# EAGLE design Compressions_TOF_VLX6180_v1.3.1_mar2022 (EAGLE 9.6.2)
COMPANY: Adafruit Industries; DRAWN: KTOWN; REV: A
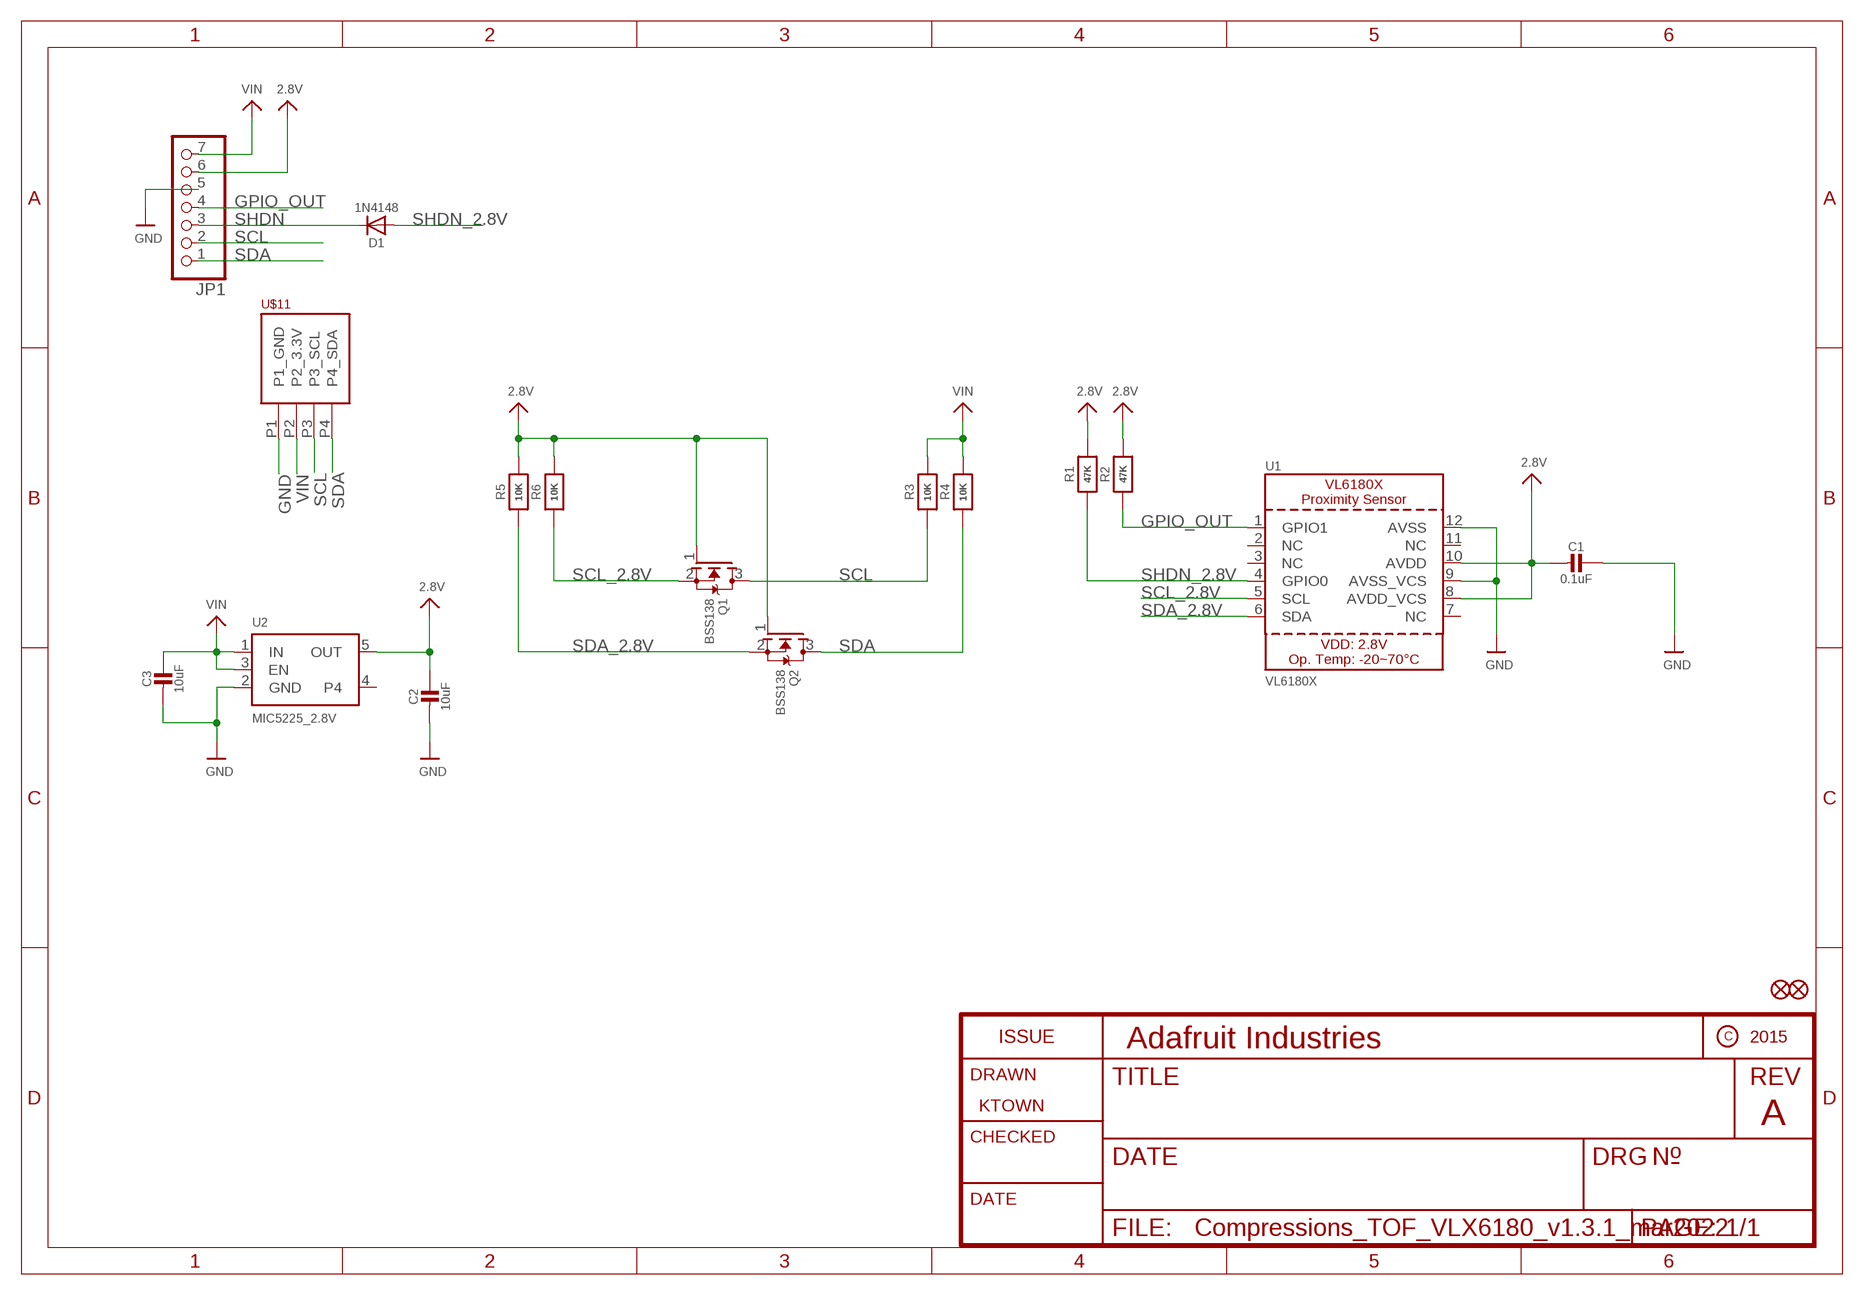
[diagram p0: schematic, sheet 1]

## Parts
C1  0.1uF  CAP_CERAMIC0805-NOOUTLINE  [0805-NO]
C2  10uF  CAP_CERAMIC0805-NOOUTLINE  [0805-NO]
C3  10uF  CAP_CERAMIC0805-NOOUTLINE  [0805-NO]
D1  1N4148  DIODESOD-323  [SOD-323]
FID1  FIDUCIAL""  [FIDUCIAL_1MM]
FID2  FIDUCIAL""  [FIDUCIAL_1MM]
JP1  HEADER-1X770MIL  [1X07_ROUND_70]
Q1  BSS138  MOSFET-NWIDE  [SOT23-WIDE]
Q2  BSS138  MOSFET-NWIDE  [SOT23-WIDE]
R1  47K  RESISTOR0805_NOOUTLINE  [0805-NO]
R2  47K  RESISTOR0805_NOOUTLINE  [0805-NO]
R3  10K  RESISTOR0805_NOOUTLINE  [0805-NO]
R4  10K  RESISTOR0805_NOOUTLINE  [0805-NO]
R5  10K  RESISTOR0805_NOOUTLINE  [0805-NO]
R6  10K  RESISTOR0805_NOOUTLINE  [0805-NO]
U1  VL6180X  [VL6180]
U2  MIC5225_2.8V  VREG_SOT23-5  [SOT23-5]
U$11  PHOENIX_PTSM_M4_THANGLE  [PTSM_M4_TH]

## Nets
2.8V: C1.2 C2.1 JP1.6 Q1.1(G) Q2.1(G) R1.2 R2.2 R5.2 R6.2 U1.8(AVDD_VCS) U1.10(AVDD) U2.5(OUT)
GND: C1.1 C2.2 C3.2 JP1.5 U1.9(AVSS_VCS) U1.12(AVSS) U2.2(GND) U$11.P1(P1_GND)
GPIO_OUT: JP1.4 R2.1 U1.1(GPIO1)
SCL: JP1.2 Q1.3(D) R3.1 U$11.P3(P3_SCL)
SCL_2.8V: Q1.2(S) R6.1 U1.5(SCL)
SDA: JP1.1 Q2.3(D) R4.1 U$11.P4(P4_SDA)
SDA_2.8V: Q2.2(S) R5.1 U1.6(SDA)
SHDN: D1.C JP1.3
SHDN_2.8V: D1.A R1.1 U1.4(GPIO0)
VIN: C3.1 JP1.7 R3.2 R4.2 U2.1(IN) U2.3(EN) U$11.P2(P2_3.3V)
Unconnected: U1.2(NC) U1.3(NC) U1.7(NC) U1.11(NC) U2.4

## Library data of the parts
C1-C3 = microbuilder:CAP_CERAMIC: Ceramic Capacitors For new designs, use the packages preceded by an '_' character since they are more reliable: The following footprints should be used on most boards: _0402 - Standard footprint for regular board layouts _0603 - Standard footprint for regular board layouts _0805 - Standard footprint for regular board layouts _1206 - Standard footprint for regular board layouts For extremely tight-pitch boards where space is at a premium, the following 'micro-pitch' footprints can be used (smaller pads, no silkscreen outline, etc.): _0402MP - Micro-pitch footprint for very dense/compact boards _0603MP - Micro-pitch footprint for very dense/compact boards _0805MP - Micro-pitch footprint for very dense/compact boards _1206MP - Micro-pitch footprint for very dense/compact boards
D1 = microbuilder:DIODE: Diode SMA Model Volts Amps Type Vf Ir Digikey # Notes SSA34-E3 40V 3A Schottky 480mV @ 3A 200uA @ 40V SSA34-E3/61TGITR-ND CDBA120-G 20V 1A Schottky 500mV @ 1A 500uA @ 20V 641-1014-6-ND REEL MBRA210 10V 2A Schottky 350mV @ 2A 700uA @ 10V MBRA210LT3 SOD-123 Model Volts Amps Type Vf Ir Order # Notes BAT54T1G 30V 200mA Schottky 800mV @ 200mA 2uA @ 25V BAT54T1GOSTR-ND B0530W 30V 500mA Schottky 430mV @ 500mA 130uA @ 30V B0530W-FDICT-ND REEL MBR120 20V 1A Schottky 340mV @ 1A MBR120VLSFT1GOSCT-ND SOD-323 Model Volts Amps Type Vf Ir Order # Notes PMEG2005EJ 20V 500mA Schottky 355mV @ 500mA 568-4110-1-ND ZLLS410 10V 570mA Schottky 380mV @ 570mA ZLLS410CT-ND 1N4148WS 75V 150mA Silicon/Simple 1V 1N4148WSFSCT-ND REEL SOD-523 Model Volts Amps Type Vf Ir Order # Notes BAT54XV2 30V 200mA Schottky 0.8V @ 100mA BAT54XV2CT-ND TB751S 30V 30mA Schottky RB751S-40TE61CT-ND SOT23-R/W (R = Solder Paste/Reflow Ovens, W = Hand-Soldering) Model Volts Amps Type Vf Ir Order # Notes BAT54FILM 40V 300mA Schottky 497-7162-1-ND POWERDI-5 Model Volts Amps Type Vf Ir Order # Notes PDS560 60V 5A Schottky 670mV @ 5A 150uA @ 60V PDS560DICT-ND
FID1 FID2 = microbuilder:FIDUCIAL: Fiducial Alignment Points Various fiducial points for machine vision alignment.; BOM: EXCLUDE
JP1 = microbuilder:HEADER-1X7: PIN HEADER
Q1 Q2 = microbuilder:MOSFET-N: N-Channel Mosfet LEGEND VDS: Voltage Drain-Source ID: Drain Current RDS(ON): Drain-Source On-State Resistance VGS(TH): Gate-Source Threshold Voltage CISS: Drain-Source Input Capacitance SOT-23 Name VDS ID RDS(ON) VGS(TH) CISS Order Number 2N7002E 60V 260mA 2.5 Ohm 2.5V @ 250uA 26.7pF @ 25V 2N7002ET1GOSTR-ND BSH103 30V 850mA 400 mOhm 400mV @ 1mA 83pF @ 24V BSH103,235-ND BSS138 60V 320mA 1.6 Ohm 1.5V @ 250uA 50pF @ 10V Mouser: 771-BSS138PW115 DMN2075U-7 20V 4.2A 38 mOhm 1V @ 250 uA 594.3pF @ 10V DMN2075U-7DICT-ND * BSS138 good choice for I2C level-shifting POWERPAK 1212-8 Name VDS ID RDS(ON) VGS(TH) CISS Order Number Si7308DN 60V 6A 58 mOhm 3V @ 250uA 665pF @ 15V SI7308DN-T1-E3CT-ND
R1-R6 = microbuilder:RESISTOR: Resistors For new designs, use the packages preceded by an '_' character since they are more reliable: The following footprints should be used on most boards: _0402 - Standard footprint for regular board layouts _0603 - Standard footprint for regular board layouts _0805 - Standard footprint for regular board layouts _1206 - Standard footprint for regular board layouts For extremely tight-pitch boards where space is at a premium, the following 'micro-pitch' footprints can be used (smaller pads, no silkscreen outline, etc.): _0402MP - Micro-pitch footprint for very dense/compact boards _0603MP - Micro-pitch footprint for very dense/compact boards _0805MP - Micro-pitch footprint for very dense/compact boards _1206MP - Micro-pitch footprint for very dense/compact boards
U1 = microbuilder:VL6180X: VL6180x Proximity and Light Sensor with Gesture Recognition Supply Level: 2.8V (3.0V Max!) Range: 0-10cm Light Sensor: 0..100K Lux (16-bit output) IR emitter: 850 nm I2C Address: 0x29 (7-bit)
U2 = microbuilder:VREG_SOT23-5: SOT23-5 Fixed Voltage Regulators Part Current Out V Out V In V Dropout θJA (°C/W) TJ (°C) Digikey Part No. ADP121 150mA 3.3V 3.4-5.5V 0.09V @ 150mA -- -- ADP121-AUJZ33R7CT-ND ADP121 150mA 3.0V 3.1-5.5V 0.09V @ 150mA -- -- ADP121-AUJZ30R7CT-ND ADP122 300mA 3.3V 3.4-5.5V 0.085V @ 300mA -- -- ADP122AUJZ-3.3-R7CT-ND ADP1712 300mA 3.3V 3.5-5.5V 0.17V @ 300mA -- -- ADP1712AUJZ-3.3-R7TR-ND AP7311 (Low Cost) 150mA 3.3V 3.5-6V 0.15V @ 150mA -- -- AP7311-33WG-7DICT-ND LD39015M18R 150mA 1.8V 1.9V-5.5V 0.08V @ 100mA -- -- 497-6977-1-ND LP2985A-33DBVR 150mA 3.3V 3.3-16V 0.28V @ 150mA 206 150 296-18479-1-ND MCP1824T-3302E/OT 300mA 3.3V 3.5V-6V 0.2V @ 300mA -- -- MCP1824T-3302E/OTCT-ND MIC5205-2.5YM5 TR 150mA 2.5V 2.7-16V 0.165V @ 150mA -- -- 576-1257-2-ND MIC5205-3.0YM5 TR 150mA 3.0V 3.2V-16V 0.165V @ 150mA -- -- 576-1258-2-ND MIC5205-3.3YM5 TR 150mA 3.3V 3.5V-16V 0.165V @ 150mA -- -- 576-1259-2-ND TPS780330220 150mA 3.3V+2.2V 3.6-5.5V 250mV Max -- -- 296-23332-1-ND TDA3663/N1,135 100mA 3.3V 3.5-45V 0.18V @ 50mA -- -- 568-5343-1-ND Max operating temp can be calculated using θJA, TJ (max junction temperature), and power in watts. Set the "Maximum Ambient Temperature" until it reaches TJ ("Max Junction Temperature"), which is the absolute limit for safe use of the regulator: Heat Sink Temperature Calculator <http://www.daycounter.com/Calculators/Heat-Sink-Temperature-Calculator.phtml> For example, With 12V source into a 3.3V LP2985 and a 30mA load, we are dissipating (12V-3.3V) * 0.03A = 0.261W. With a θJA of 206 °C/W, a TJ of 150°C, and 261mW we can safely use the chip without a heat sink up to 75°C (=147.1°C Junction Temperature).
U$11 = jk_customs:PHOENIX_PTSM_M4_TH

## Board
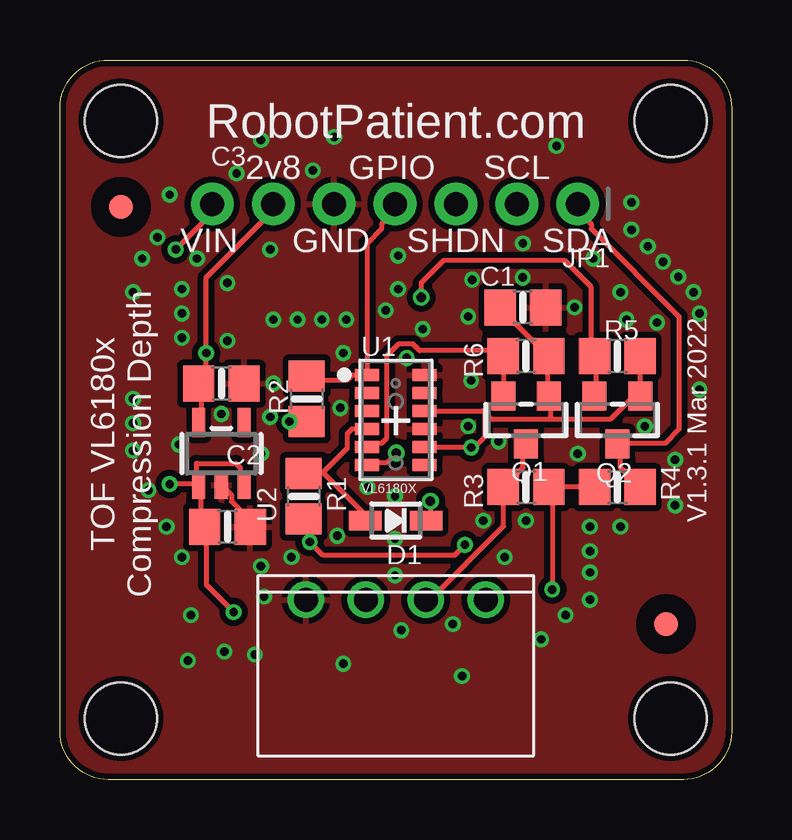
[diagram p1: board, top side]
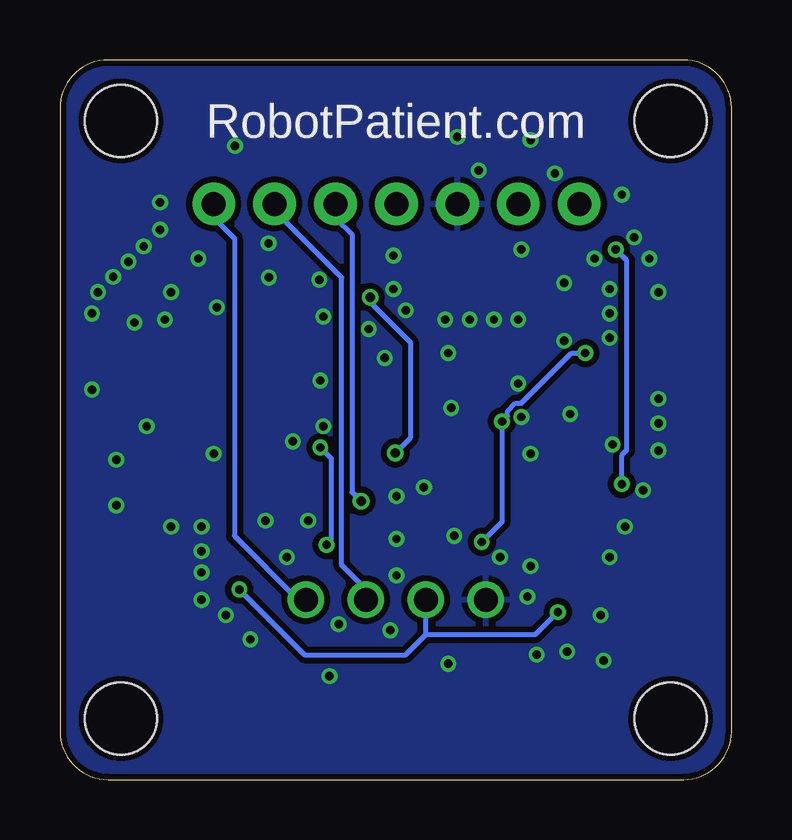
[diagram p2: board, bottom side, seen from below]

Size 28 x 30 mm. Coordinates in mm from the lower left corner, seen from the top.
Outline: 2,30 26,30 arc-90 28,28 28,2 arc-90 26,0 2,0 arc-90 0,2 0,28 arc-90 2,30
Copper layers (1*16): Top 0.035mm / dielectric 1.5mm / Bottom 0.035mm
Design rules "SeeedStudio_2layer_DRU_no_angle_20140221": minimum track width 6mil, minimum drill 12mil, track to track 6mil, track to pad 6mil, pad to pad 6mil, via to via 6mil, smd to smd 0mil, copper to edge 10mil, drill to drill 10mil, minimum pad ring 10mil, minimum via ring 6mil, stop-mask expansion 2mil, vias tented up to drill 100mil, thermal gap 10mil
Holes 3 mm at 2.54,2.54 25.46,2.54 2.54,27.46 25.46,27.46

### Footprints (pad centres in the part's own frame; a part is rotated, then mirrored left to right if it is on the bottom)
0805-NO = smd 1.3 x 1.5: 1 -0.95,0; 2 0.95,0
SOD-323 = smd 1.35 x 0.8: A 1.27,0; C -1.27,0
FIDUCIAL_1MM = smd 1 x 1: 1 0,0
1X07_ROUND_70 = drill 1 pad 1.778: 1 -7.62,0; 2 -5.08,0; 3 -2.54,0; 4 0,0; 5 2.54,0; 6 5.08,0; 7 7.62,0
SOT23-WIDE = smd 1 x 1.2: 1 -0.95,-1; 2 0.95,-1; 3 0,1
VL6180 = smd 1 x 0.5: 1 -1.2,1.875; 2 -1.2,1.125; 3 -1.2,0.375; 4 -1.2,-0.375; 5 -1.2,-1.125; 6 -1.2,-1.875; 7 1.2,-1.875; 8 1.2,-1.125; 9 1.2,-0.375; 10 1.2,0.375; 11 1.2,1.125; 12 1.2,1.875
SOT23-5 = smd 0.55 x 1.2: 1 -0.95,-1.3; 2 0,-1.3; 3 0.95,-1.3; 4 0.95,1.3; 5 -0.95,1.3
PTSM_M4_TH = drill 1: P1 3.75,1; P2 1.25,1; P3 -1.25,1; P4 -3.75,1

### Placement (x,y rotation side)
C1  19.3,19.68 180 top
C2  6.73,16.51 0 top
C3  6.99,10.54 0 top
D1  14,10.79 180 top
FID1  2.54,23.88 0 top
FID2  25.27,6.48 0 top
JP1  13.97,24 180 top
Q1  19.43,14.99 180 top
Q2  23.24,14.99 180 top
R1  10.16,11.81 270 top
R2  10.29,15.88 270 top
R3  19.43,12.19 0 top
R4  23.24,12.19 180 top
R5  23.24,17.65 0 top
R6  19.43,17.65 0 top
U1  14,15 0 top
U2  6.73,13.59 0 top
U$11  14,8.5 180 top

### Tracks (layer width: path | path; a pad name or v marks a point on that pad's centre or on a via)
2.8V  (via drill 0.35)
  Top 0.2: R1.2 10.41,10.61 v10.41,9.91 | R2.2 v9.57,14.93
  Top 0.203: R5.2 24.18,17.48 24.18,16.05 Q2.1 24.18,15.85 23.77,15.85 22.96,15.04 20.45,15.04 | 20.32,16.26 20.32,17.48 R6.2 20.32,17.68 18.49,19.51 C1.2 | 20.32,16.26 20.32,16.05 Q1.1 | 20.32,16.26 Q1.1 | U2.5 5.89,15.04 5.89,16.46 C2.1 5.89,16.66 6.1,16.87 v6.1,17.78 6.1,20.93 8.74,23.57 8.74,23.98 JP1.6 | v10.41,9.91 10.97,9.35 16.45,9.35 v16.89,9.78 | U1.10 17.63,15.38 17.71,15.3 | 17.71,15.3 17.97,15.04 20.45,15.04 | Q1.1 20.45,15.92 20.45,15.04 | 17.71,15.3 17.71,14.34 17.71,14.28 17.17,13.74 17.14,13.74 | 17.14,13.74 v17.14,13.84 | 17.14,13.74 17.01,13.88 U1.8
  Bottom 0.2: v10.41,9.91 9.57,10.75 v9.57,14.93 9.34,15.15 9.34,15.35 9,15.69 8.76,15.69 6.67,17.78 v6.1,17.78
  Bottom 0.203: v17.14,13.84 16.69,13.39 16.69,9.98 v16.89,9.78
GND  (via drill 0.35)
  Top 0.203: U2.2 7.15,11.87 7.15,11.58 7.93,10.8 C3.2
  other vias: 10.92,19.18 8.89,19.18 9.91,19.18 14.1,21.84 14.1,20.45 17.02,19.3 17.14,16.64 18.29,14.1 21.59,13.59 22.1,10.54 22.1,9.53 22.1,8.64 21.08,6.86 20.07,5.84 16.38,6.48 19.43,10.79 17.65,10.79 13.97,11.81 13.97,10.03 11.56,10.16 11.68,15.49 8.76,15.11 6.73,15.24 4.95,13.97 8.38,8.89 9.65,9.27 5.08,9.27 4.45,10.54 3.68,12.06 3.05,13.72 3.05,14.86 3.05,15.88 5.08,18.41 5.08,19.43 5.08,20.45 5.71,21.72 4.06,22.61 3.43,21.72 3.05,20.32 8.38,26.67 11.43,26.8 20.7,26.42 24.51,22.23 19.3,22.35 23.37,20.32 21.46,19.68 23.62,19.18 24.38,14.73 17.02,14.73 8.51,7.62 5.46,6.86 8.13,5.21 6.86,5.33 14.22,6.22 11.81,4.83 16.76,4.32 18.54,9.27 13.97,8.51 14.45,17.58 6.99,18.29 8.89,16.51 11.81,17.78 13.59,19.56 11.94,19.18 6.99,20.7 4.57,24.38 7.37,25.27 10.54,25.4 8.76,22.1 25.65,13.34 24.89,19.05 22.23,21.72 22.1,7.49 5.33,4.95 8.38,13.59 12.83,12.19 15.13,18.78 19.29,20.93 17.18,20.84 23.83,22.92 23.83,24.07 25.15,21.59 25.78,20.95 26.42,20.32 26.67,19.43 26.67,16.26 25.65,11.43 23.37,10.54
  pour Top (isolate 0.254): -3.81,-20.57 -3.81,32 71.75,32 71.75,-20.57
  pour Bottom (isolate 0.254): -2.03,-21.59 -2.03,30.35 72.39,30.35 72.39,-21.59
GPIO_OUT
  Top 0.203: R2.1 10.36,16.66 11.99,16.66 12.19,16.87 12.6,16.87 U1.1 12.8,17.07 12.8,22.35 13.41,22.96 13.41,23.16 13.82,23.57 13.82,23.98 JP1.4
SCL
  Top 0.203: R3.1 19.3,13.01 19.3,13.82 Q1.3 | R3.1 18.49,10.57 15.44,7.52 U$11.P3 | R3.1
  Bottom 0.203: JP1.2 18.9,23.98 18.9,23.57 16.26,20.93 16.26,8.94 15.44,8.13 15.44,7.52 U$11.P3
SCL_2.8V
  Top 0.203: U1.5 12.8,14.02 13.41,14.02 13.61,14.22 13.61,17.65 14.12,18.16 14.72,18.16 15,17.88 18.09,17.88 18.29,17.68 R6.1 18.49,17.48 18.49,16.05 Q1.2
SDA
  Top 0.203: R4.1 23.37,13.01 23.37,13.82 Q2.3 23.37,14.02 25.22,14.02 25.81,14.61 25.81,19.3 22.15,22.96 22.15,23.16 21.74,23.57 21.74,23.98 JP1.1
  Bottom 0.203: U$11.P4 17.88,7.52 18.09,7.52 20.73,10.16 20.73,22.55 21.54,23.37 21.54,23.98 JP1.1
SDA_2.8V  (via drill 0.39)
  Top 0.203: v14.02,13.61 13.61,13.21 12.8,13.21 U1.6 | v15.06,20.1 15.06,20.7 15.99,21.63 21.04,21.63 22.15,20.52 22.15,17.68 R5.1 22.35,17.48 22.35,16.05 Q2.2
  Bottom 0.203: v14.02,13.61 13.39,14.25 13.39,18.21 15.06,19.89 v15.06,20.1
SHDN  (via drill 0.39)
  Top 0.203: v15.44,11.61 15.44,10.97 D1.C
  Bottom 0.203: v15.44,11.61 15.82,11.99 15.82,22.73 16.46,23.37 16.46,23.98 JP1.3
SHDN_2.8V
  Top 0.203: 10.97,12.8 11.99,13.82 11.99,14.43 12.19,14.63 12.6,14.63 U1.4 | 10.97,12.8 10.16,12.8 R1.1 | 10.97,12.8 12.6,11.18 12.6,10.97 D1.A
VIN  (via drill 0.35)
  Top 0.2: U2.1 5.75,12.32 v4.57,12.32
  Top 0.203: U2.3 7.52,12.39 7.52,13.01 7.34,13.18 5.69,13.18 5.69,12.39 U2.1 5.89,12.19 5.89,10.57 C3.1 6.1,10.48 6.1,8.13 v7.24,6.99 | R4.2 20.52,12.19 | 20.52,12.19 v20.52,7.92 | 20.52,12.19 R3.2 | v4.83,22.1 6.3,23.57 6.3,23.98 JP1.7
  Bottom 0.2: v4.57,12.32 4.57,13.53 4.37,13.73 4.37,21.64 v4.83,22.1
  Bottom 0.203: v20.52,7.92 17.8,5.21 13.59,5.21 12.76,6.03 | U$11.P2 12.75,6.05 12.76,6.03 | v7.24,6.99 8.19,6.03 12.76,6.03

### Text on the board
tPlace: 2v8 | GPIO | SCL | VIN | GND | SHDN | SDA
bPlace: RobotPatient.com
tSilk: RobotPatient.com | + | TOF VL6180x / Compression Depth